# Altium schematic sheet MCU.SchDoc
size A4; SheetNumber: 5; SheetTotal: 6
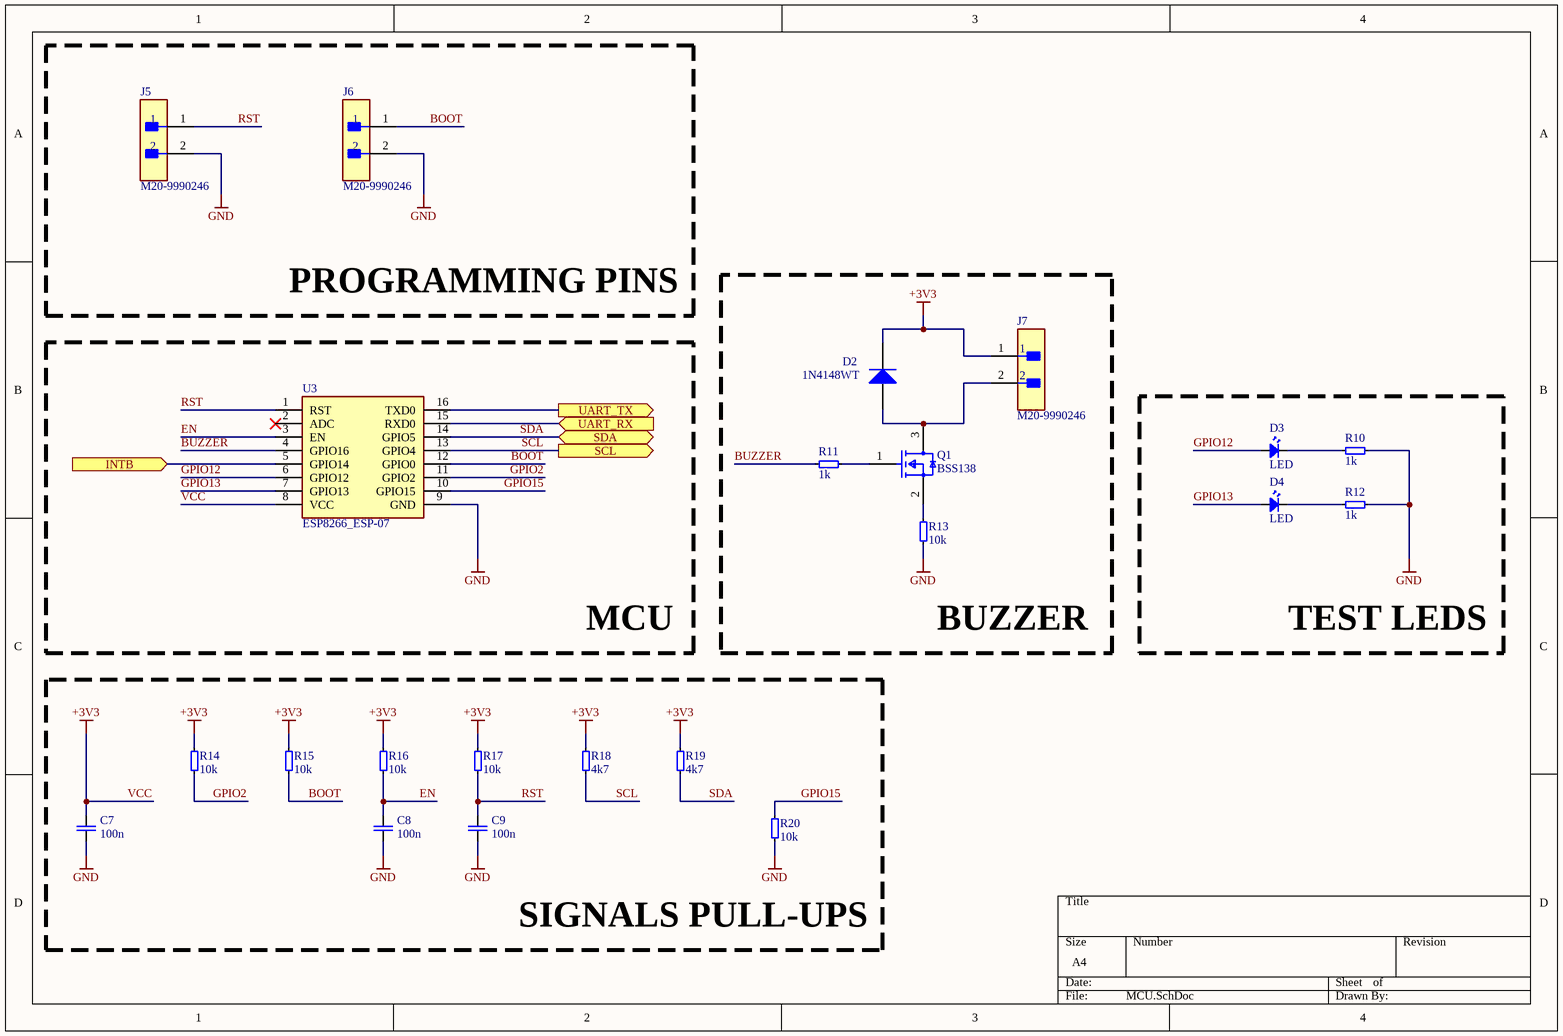
[diagram p0: MCU.SchDoc]

## Parts
C7  100n  [C0603]
C8  100n  [C0603]
C9  100n  [C0603]
D2  1N4148WT  [FAIR-SOD-523F-2_V]
D3  LED  [LED0603]
D4  LED  [LED0603]
J5  M20-9990246  [FP-M20-9990246-MFG]
J6  M20-9990246  [FP-M20-9990246-MFG]
J7  M20-9990246  [FP-M20-9990246-MFG]
Q1  BSS138  [FP-318-08-IPC_B]
R10  1k  [R0603]
R11  1k  [R0603]
R12  1k  [R0603]
R13  10k  [R0603]
R14  10k  [R0603]
R15  10k  [R0603]
R16  10k  [R0603]
R17  10k  [R0603]
R18  4k7  [R0603]
R19  4k7  [R0603]
R20  10k  [R0603]
U3  ESP8266_ESP-07  [ESP8266ESP07]

## Blocks framed on the sheet
PROGRAMMING PINS: J5 J6
BUZZER: D2 J7 Q1 R11 R13
MCU: U3
TEST LEDS: D3 D4 R10 R12
SIGNALS PULL-UPS: C7-C9 R14-R20

## Ports
INTB (in, see MED_BOX[3B], I2C_GPIO_EXPANDER[1A]), SCL (out, see MED_BOX[3B], I2C_GPIO_EXPANDER[1B], RTC[1A]), SDA (bidir, see MED_BOX[3B], I2C_GPIO_EXPANDER[1B], RTC[1A]), UART_RX (in, see MED_BOX[2B]), UART_TX (out, see MED_BOX[2B])

## Nets
GND: C7.1 C8.1 C9.1 J5.2 J6.2 R10.2 R12.2 R13.1 R20.1 U3.9(GND)
VCC: C7.2 D2.1(K) J7.1 R14.2 R15.2 R16.2 R17.2 R18.2 R19.2 U3.8(VCC)  [also labelled +3V3]
BOOT: J6.1 R15.1 U3.12(GPIO0)
BUZZER: R11.2 U3.4(GPIO16)
EN: C8.2 R16.1 U3.3(EN)
GPIO2: R14.1 U3.11(GPIO2)
GPIO12: D3.A U3.6(GPIO12)
GPIO13: D4.A U3.7(GPIO13)
GPIO15: R20.2 U3.10(GPIO15)
INTB: U3.5(GPIO14) ; port INTB
RST: C9.2 J5.1 R17.1 U3.1(RST)
SCL: R18.1 U3.13(GPIO4) ; port SCL
SDA: R19.1 U3.14(GPIO5) ; port SDA
UART_RX: U3.15(RXD0) ; port UART_RX
UART_TX: U3.16(TXD0) ; port UART_TX
NetD2_2: D2.2(A) J7.2 Q1.3(D)
NetD3_K: D3.K R10.1
NetD4_K: D4.K R12.1
NetQ1_1: Q1.1(G) R11.1
NetQ1_2: Q1.2(S) R13.2

Not connected (* = marked no-connect by the designer): U3 2(ADC)*

## Library data of the parts
C7-C9 = CMP-00024-8: Generic 0603 SMD Ceramic Capacitor
D2 = CMP-0881-00001-1: High Conductance Fast Switching Diode, 75 V, -55 to 150 degC, 2-Pin SOD523F, RoHS; Manufacturer: Fairchild Semiconductor; IR (VR: 75 V)=5 uA Max.; VF: 1 V Max.; BVR (IR: 5 uA)=75 V Min.; CO: 4 pF Max.; DatasheetVersion: Rev. A2; ComponentLink1Description: Manufacturer URL; PackageDescription: 2-Pin Surface Mount Device, Body 1.2 x 0.8 mm, Height 0.7 mm; ComponentLink2URL: http://www.fairchildsemi.com/ds/1N/1N4148WT.pdf; ComponentLink2Description: Datasheet; PartNumber: 1N4148WT; ComponentLink1URL: http://www.fairchildsemi.com/; Temperature Range: -55 to 150 degC; Mounting Technology: Surface Mount; PackageReference: SOD-523F-2; RoHS: TRUE
D3 D4 = CMP-00036-7: 0603 LED
J5-J7 = CMP-15831-000009-1: CONN HEADER VERT 2POS 2.54MM; Manufacturer: Harwin; Conn Gender: Male; Conn Orientation: Vertical; Number Of Contacts: 2; Current Rating: 3A; ComponentLink2URL: https://cdn.harwin.com/pdfs/M20-999.pdf; ComponentLink2Description: Datasheet; Package: M20-9990246; Temperature: -40°C to +105°C; Octopart: https://octopart.com/m20-9990246-harwin-2590635; Mouser Description: 2.54mm (0.1") Pitch SIL Vertical PC Tail Pin Header, 6.1mm mating pin height, tin, 2 contacts; Temperature Range High: +105°C; Device Class L1: Connectors; RoHS: TRUE; Automotive: No; Height: 8.99mm; Number Of Rows: 1; Contact Material: Tin,Nickel; Category: Conn; Pitch: 2.54mm; Lead Free: Yes; Digikey Description: CONN HEADER VERT 2POS 2.54MM; Manufacturer Part Number: M20-9990246; Temperature Range Low: -40°C; Device Class L3: unset; Device Class L2: Headers and Wire Housings
Q1 = CMP-07173-000101-1: MOSFET N-CH 50V 220MA SOT-23; Turn-Off Delay Time: 20ns; Element Configuration: Single; Rds On Max: 3.5R; Gate to Source Voltage (Vgs): 20V; Threshold Voltage: 1.3V; Number of Elements: 1; Power Dissipation: 360mW; Rise Time: 9ns; Turn-On Delay Time: 2.5ns; Input Capacitance: 27pF; On-State Resistance: 6R; Lead Free: Lead Free; Length: 2.92mm; Width: 1.3mm; Drain to Source Breakdown Voltage: 50V; Min Operating Temperature: -55°C; REACH SVHC: No SVHC; Packaging: Tape and Reel; Radiation Hardening: No; Height: 0.93mm; Drain to Source Voltage (Vdss): 50V; Current Rating: 220mA; Voltage Rating (DC): 50V; Weight: 0.03g; Continuous Drain Current (ID): 220mA; Number of Pins: 3; Nominal Vgs: 1.3V; Max Power Dissipation: 360mW; Fall Time: 9ns; Drain to Source Resistance: 3.5R; Contact Plating: Tin; Case/Package: SOT-23; Package Quantity: 1; Dual Supply Voltage: 50V; Mount: Surface Mount; Termination: SMD/SMT; Max Operating Temperature: 150°C
R10-R20 = CMP-00017-10: Generic 0603 SMD Resistor
U3 = ESP8266_ESP-07: Connector; Manufacturer_Name: Ai-Thinker; Manufacturer_Part_Number: ESP8266 ESP-07; Datasheet Link: http://datasheet.octopart.com/ESP-07S-RF-Solutions-datasheet-104506015.pdf; Height: 3mm